# Altium schematic sheet 3V3_LDO.SchDoc
size A; SheetNumber: 15; SheetTotal: 16
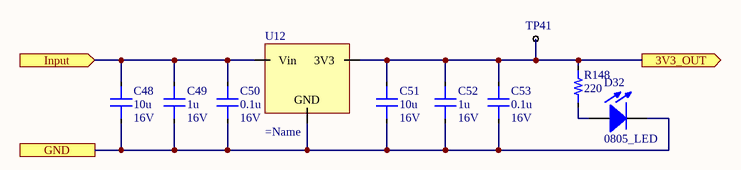
[diagram p0: 3V3_LDO.SchDoc]

## Parts
C48  value 10u  Voltage: 16V  [0805_CAP]  (hidden comment: Capacitor)
C49  value 1u  Voltage: 16V  [0603_CAP]  (hidden comment: Capacitor)
C50  value 0.1u  Voltage: 16V  [0805_CAP]  (hidden comment: Capacitor)
C51  value 10u  Voltage: 16V  [0805_CAP]  (hidden comment: Capacitor)
C52  value 1u  Voltage: 16V  [0805_CAP]  (hidden comment: Capacitor)
C53  value 0.1u  Voltage: 16V  [0805_CAP]  (hidden comment: Capacitor)
D32  0805_LED  [0805_LED]
R148  value 220  [0603_RES]  (hidden comment: Resistor)
TP41  1mm Testpoint  [1mm_testpoint]  (value not drawn)
U12  (no value)  [DPAK3_TO-252-3]

## Ports
3V3_OUT (out), GND, Input (in)

## Nets
3V3_OUT: C51.2 C52.2 C53.2 R148.2 TP41.1 U12.4(3V3) ; port 3V3_OUT
GND: C48.1 C49.1 C50.1 C51.1 C52.1 C53.1 D32.2(K) U12.1(GND) ; port GND
Input: C48.2 C49.2 C50.2 U12.3(Vin) ; port Input
NetD32_1: D32.1(A) R148.1

## Library data of the parts
D32 = 0805_LED: Generic 0805 LED; Color: Green
TP41 = 1mm Testpoint: 1mm test point; ComponentLink1Description: Digikey; ComponentLink1URL: https://www.digikey.com/product-detail/en/te-connectivity-amp-connectors/RCU-0C/A106145CT-ND/3477802
U12 = NCP1117DT33T5G: IC REG LINEAR 3.3V 1A DPAK
C48-C53 = Capacitor: Dielectric: *; Percent Tolerance: *; ESR: *
R148 = Resistor: Tolerance: *